# Altium schematic sheet Switch1 copy.SchDoc
size 299 x 312 mm
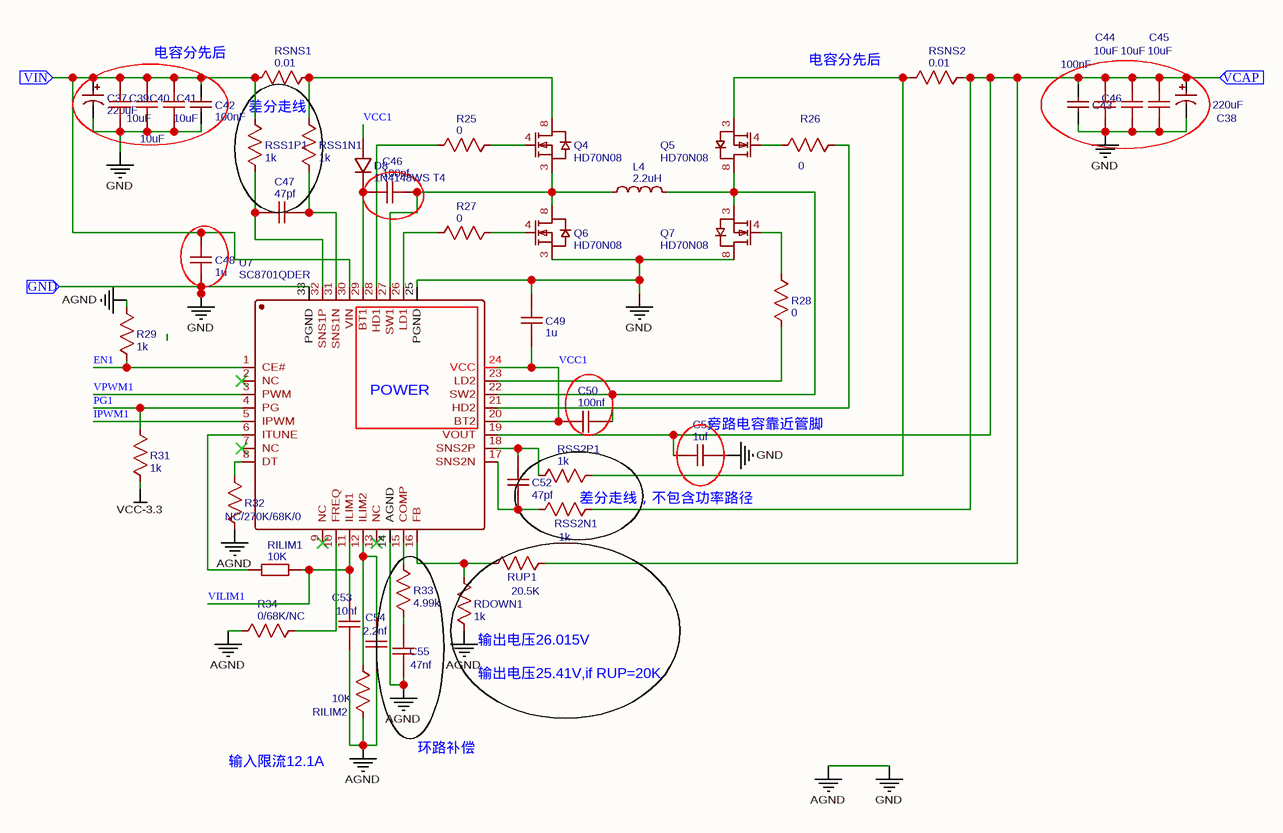
[diagram p0: Switch1 copy.SchDoc]

## Parts
C37  220uF  [CAP-SMD_BD10.0-L10.3-W10.3-FD]
C38  220uF  [CAP-SMD_BD10.0-L10.3-W10.3-FD]
C39  10uF  [C1206]
C40  10uF  [C1206]
C41  10uF  [C1206]
C42  100nF  [C0603]
C43  100nF  [C0603]
C44  10uF  [C1206]
C45  10uF  [C1206]
C46  100nf  [C0402]
C47  47pf  [C0402]
C48  1u  [C0402]
C49  1u  [C0402]
C50  100nf  [C0402]
C51  1uf  [C0402]
C52  47pf  [C0402]
C53  10nf  [C0402]
C54  2.2nf  [C0402]
C55  47nf  [C0402]
D8  1N4148WS T4  [SOD-323_L1.8-W1.3-LS2.5-FD]
L4  2.2uH  [IND-SMD_L17.5-W17.0_YXMAC1770]
NO1  10uF  [C1206]
Q4  HD70N08  [PDFN-8_L4.9-W5.8-P1.27-LS6.1-BL FOR3]
Q5  HD70N08  [PDFN-8_L4.9-W5.8-P1.27-LS6.1-BL FOR3]
Q6  HD70N08  [PDFN-8_L4.9-W5.8-P1.27-LS6.1-BL FOR3]
Q7  HD70N08  [PDFN-8_L4.9-W5.8-P1.27-LS6.1-BL FOR3]
R25  0  [R0603]
R26  0  [R0603]
R27  0  [R0603]
R28  0  [R0603]
R29  1k  [R0402]
R31  1k  [R0402]
R32  NC/270K/68K/0  [R0402]
R33  4.99k  [R0402]
R34  0/68K/NC  [R0402]
RDOWN1  1k  [R0402]
RILIM1  10K  [R0402]
RILIM2  10K  [R0402]
RSNS1  0.01  [R0805]
RSNS2  0.01  [R0805]
RSS1N1  1k  [R0402]
RSS1P1  1k  [R0402]
RSS2N1  1k  [R0402]
RSS2P1  1k  [R0402]
RUP1  20.5K  [R0402]
U7  SC8701QDER  [QFN-32_L4.0-W4.0-P0.4-BL-EP2.6]

## Blocks framed on the sheet
POWER: U7

## Ports
GND (in), VCAP (in), VIN (in)

## Nets
AGND: C37.2 C38.2 C39.1 C40.1 C41.1 C42.1 C43.1 C44.1 C45.1 C48.1 C49.2 C51.1 C53.1 C54.1 C55.1 NO1.1 Q6.3(S) Q7.8(D) R29.2 R32.1 R34.1 RDOWN1.1 RILIM2.1 U7.14(AGND) U7.25(PGND) U7.33(PGND) ; port GND  [also labelled GND]
VCC-3.3: R31.1
EN1: R29.1 U7.1(CE#)
IPWM1: U7.5(IPWM)
PG1: R31.2 U7.4(PG)
VCAP: C38.1 C43.2 C44.2 C45.2 C51.2 NO1.2 RSNS2.2 RSS2N1.2 RUP1.2 U7.19(VOUT) ; port VCAP
VCC1: C49.1 C50.2 D8.1(A) U7.20(BT2) U7.24(VCC)
VILIM1: C53.2 RILIM1.2 U7.11(ILIM1)
VIN: C37.1 C39.2 C40.2 C41.2 C42.2 C48.2 RSNS1.1 RSS1P1.2 U7.30(VIN) ; port VIN
VPWM1: U7.3(PWM)
NetC46_1: C46.1 D8.2(K) U7.29(BT1)
NetC46_2: C46.2 L4.1 Q4.3(S) Q6.8(D) U7.27(SW1)
NetC47_1: C47.1 RSS1N1.1 U7.31(SNS1N)
NetC47_2: C47.2 RSS1P1.1 U7.32(SNS1P)
NetC50_1: C50.1 L4.2 Q5.8(D) Q7.3(S) U7.22(SW2)
NetC52_1: C52.1 RSS2P1.1 U7.18(SNS2P)
NetC52_2: C52.2 RSS2N1.1 U7.17(SNS2N)
NetC54_2: C54.2 RILIM2.2 U7.12(ILIM2)
NetC55_2: C55.2 R33.1
NetQ4_4: Q4.4(G) R25.2
NetQ4_8: Q4.8(D) RSNS1.2 RSS1N1.2
NetQ5_3: Q5.3(S) RSNS2.1 RSS2P1.2
NetQ5_4: Q5.4(G) R26.1
NetQ6_4: Q6.4(G) R27.2
NetQ7_4: Q7.4(G) R28.2
NetR25_1: R25.1 U7.28(HD1)
NetR26_2: R26.2 U7.21(HD2)
NetR27_1: R27.1 U7.26(LD1)
NetR28_1: R28.1 U7.23(LD2)
NetR32_2: R32.2 U7.8(DT)
NetR33_2: R33.2 U7.15(COMP)
NetR34_2: R34.2 U7.10(FREQ)
NetRDOWN1_2: RDOWN1.2 RUP1.1 U7.16(FB)
NetRILIM1_1: RILIM1.1 U7.6(ITUNE)

Not connected (* = marked no-connect by the designer): U7 2(NC)* 7(NC)* 9(NC)* 13(NC)*

## Notes on the sheet
- 电容分先后
- (near RSS1P1) 差分走线
- (near C44) C46
- (near C51) 旁路电容靠近管脚
- (near RSS2N1) 差分走线，不包含功率路径
- (near RDOWN1) 输出电压26.015V
- (near RDOWN1) 输出电压25.41V,if RUP=20K
- 输入限流12.1A
- 环路补偿

## Library data of the parts
C37 C38 = 220uF: BOM_Manufacturer: CapXon; BOM_Manufacturer Part: DV221M050G105A; nameAlias: Capacitance; BOM_Supplier: LCSC; BOM_Supplier Part: C65217; spicePre: C; spiceSymbolName: DV221M050G105A
C39-C41 C44 C45 NO1 = 10uF: BOM_Manufacturer: MuRata; BOM_Manufacturer Part: GRM31CR61H106KA12L; nameAlias: Capacitance; BOM_Supplier: LCSC; BOM_Supplier Part: C77092; spicePre: C; spiceSymbolName: GRM31CR61H106KA12L
C42 C43 = 100nF: BOM_Manufacturer Part: CL10B104JB8NNNC; BOM_Manufacturer: SAMSUNG; nameAlias: Capacitance; SMT Type: Extend; BOM_Supplier: LCSC; BOM_Supplier Part: C1525; BOM_LCSC Assembly: Yes; spicePre: C; spiceSymbolName: CL10B104JB8NNNC
C46 C50 = 100nf: nameAlias: Value(F); spicePre: C; spiceSymbolName: Cap_0402_US
C47 C52 = 47pf: nameAlias: Value(F); spicePre: C; spiceSymbolName: Cap_0402_US; BOM_Supplier Part: C1567
C48 C49 = 1u: nameAlias: Value(F); spicePre: C; spiceSymbolName: Cap_0402_US
C51 = 1uf: nameAlias: Value(F); spicePre: C; spiceSymbolName: Cap_0402_US
C53 = 10nf: nameAlias: Value(F); spicePre: C; spiceSymbolName: Cap_0402_US
C54 = 2.2nf: nameAlias: Value(F); spicePre: C; spiceSymbolName: Cap_0402_US
C55 = 47nf: nameAlias: Value(F); spicePre: C; spiceSymbolName: Cap_0402_US
D8 = 1N4148WS T4: BOM_Manufacturer: CJ; SMT Type: Basic; BOM_Supplier: LCSC; BOM_Manufacturer Part: 1N4148WS T4; BOM_LCSC Assembly: Yes; image: //image.lceda.cn/szlcsc/C2128.jpg; BOM_Supplier Part: C2128; spicePre: D; spiceSymbolName: 1N4148WS T4
L4 = 2.2uH: BOM_Manufacturer: YUXIN TECH; BOM_Manufacturer Part: YXMAC1770-2R2M-IGP; nameAlias: Inductance; Contributor: LCSC; BOM_Supplier: LCSC; BOM_Supplier Part: C241452; spicePre: L; spiceSymbolName: YXMAC1770-2R2M-IGP
Q4-Q7 = HD70N08: BOM_Manufacturer: HL; Contributor: LCSC; BOM_Supplier: LCSC; BOM_Manufacturer Part: HD70N08; spicePre: Q; spiceSymbolName: HD70N08
  Q4: BOM_Supplier Part: C190849
  Q5-Q7: BOM_Supplier Part: C216254
R25-R28 = 0: nameAlias: Value(Ω); spicePre: R; spiceSymbolName: Res_0402(1/16W)_US
R29 R31 RDOWN1 RSS1N1 RSS1P1 RSS2N1 RSS2P1 = 1k: nameAlias: Value(Ω); spicePre: R; spiceSymbolName: Res_0402(1/16W)_US
  RSS1N1 RSS1P1 RSS2N1 RSS2P1: BOM_Supplier Part: C319809
R32 = NC/270K/68K/0: nameAlias: Value(Ω); spicePre: R; spiceSymbolName: Res_0402(1/16W)_US
R33 = 4.99k: nameAlias: Value(Ω); spicePre: R; spiceSymbolName: Res_0402(1/16W)_US
R34 = 0/68K/NC: nameAlias: Value(Ω); spicePre: R; spiceSymbolName: Res_0402(1/16W)_US
RILIM1 = 10K: nameAlias: Resistance (Ohms); Contributor: LCSC; BOM_Supplier: LCSC; BOM_Supplier Part: C25744; BOM_LCSC Assembly: Yes; spicePre: R; spiceSymbolName: 0805WAD1002T5E
RILIM2 = 10K: nameAlias: Value(Ω); spicePre: R; spiceSymbolName: Res_0402(1/16W)_US
RSNS1 RSNS2 = 0.01: nameAlias: Value(Ω); spicePre: R; spiceSymbolName: Res_0402(1/16W)_US; BOM_Supplier Part: C236284
RUP1 = 20.5K: nameAlias: Value(Ω); spicePre: R; spiceSymbolName: Res_0402(1/16W)_US
U7 = SC8701QDER: BOM_Manufacturer: Southchip Semicon; Contributor: LCSC; SMT Type: Extend; BOM_Supplier: LCSC; BOM_Supplier Part: C252410; BOM_Manufacturer Part: SC8701QDER; BOM_LCSC Assembly: Yes; spicePre: U; spiceSymbolName: SC8701QDER